# EAGLE design debug_6_005_010 (EAGLE 9.4.0)
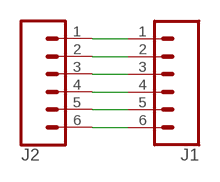
[diagram p0: schematic, sheet 1]

## Parts
J1  CONN_061.27MM  [1X06_1.27MM]
J2  CONN_06RA  [MOLEX-1X6-RA]

## Nets
N$1: J1.4 J2.4
N$2: J1.6 J2.6
N$3: J1.3 J2.3
N$4: J1.2 J2.2
N$5: J1.1 J2.1
N$6: J1.5 J2.5

## Library data of the parts
J1 J2 = SparkFun-Connectors:CONN_06: Multi connection point. Often used as Generic Header-pin footprint for 0.1 inch spaced/style header connections On any of the 0.1 inch spaced packages, you can populate with these: Break Away Headers - Straight <https://www.sparkfun.com/products/116> (PRT-00116) Break Away Male Headers - Right Angle <https://www.sparkfun.com/products/553> (PRT-00553) Female Headers <https://www.sparkfun.com/products/115> (PRT-00115) Break Away Headers - Machine Pin <https://www.sparkfun.com/products/117> (PRT-00117) Break Away Female Headers - Swiss Machine Pin <https://www.sparkfun.com/products/743> (PRT-00743) Arduino Stackable Header - 6 Pin <https://www.sparkfun.com/products/9280> (PRT-09280) For SCREWTERMINALS and SPRING TERMINALS visit here: Screw Terimnals on SparkFun.com <https://www.sparkfun.com/search/results?term=Screw+Terminals> (5mm/3.5mm/2.54mm spacing) This device is also useful as a general connection point to wire up your design to another part of your project. Our various solder wires solder well into these plated through hole pads. Hook-Up Wire - Assortment (Stranded, 22 AWG) <https://www.sparkfun.com/products/11375> (PRT-11375) Hook-Up Wire - Assortment (Solid Core, 22 AWG) <https://www.sparkfun.com/products/11367> (PRT-11367) View the entire wire category on our website here <https://www.sparkfun.com/categories/141>

## Net classes
0 default: width 0.152 mm

## Board
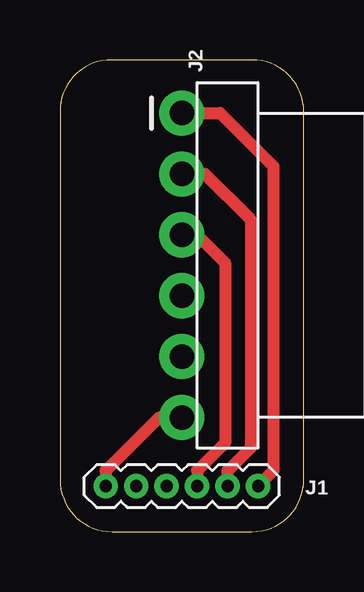
[diagram p1: board, top side]
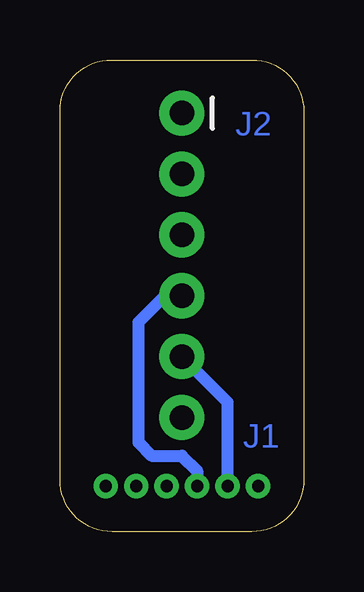
[diagram p2: board, bottom side, seen from below]

Size 10.16 x 19.68 mm. Coordinates in mm from the lower left corner, seen from the top.
Outline: 0,17.52 0,2.17 arc90 2.17,0 7.99,0 arc90 10.16,2.17 10.16,17.52 arc90 8.01,19.68 2.15,19.68 arc90 0,17.52
Copper layers (1*16): Top 0.035mm / dielectric 1.5mm / Bottom 0.035mm
Design rules "default": minimum track width 6mil, minimum drill 0.35mm, track to track 6mil, track to pad 6mil, pad to pad 6mil, via to via 6mil, smd to smd 6mil, copper to edge 40mil, drill to drill 6mil, minimum pad ring 10mil, minimum via ring 8mil, stop-mask expansion 4mil, vias tented up to drill 0mil, thermal gap 10mil

### Footprints (pad centres in the part's own frame; a part is rotated, then mirrored left to right if it is on the bottom)
1X06_1.27MM = drill 0.508 pad 1: 1 0,0; 2 1.27,0; 3 2.54,0; 4 3.81,0; 5 5.08,0; 6 6.35,0
MOLEX-1X6-RA = drill 1.016 pad 1.88: 1 0,0; 2 2.54,0; 3 5.08,0; 4 7.62,0; 5 10.16,0; 6 12.7,0

### Placement (x,y rotation side)
J1  8.26,1.91 180 top
J2  5.08,17.46 270 top

### Tracks (layer width: path | path; a pad name or v marks a point on that pad's centre or on a via)
N$1
  Bottom 0.508: J2.4 5.78,9.84 6.88,8.74 6.88,3.71 6.35,3.17 5.08,3.17 4.45,2.54 J1.4
N$2
  Top 0.508: J2.6 4.13,4.76 1.91,2.54 J1.6
N$3
  Top 0.508: J2.3 5.71,12.38 6.88,11.21 6.88,3.71 5.71,2.54 J1.3
N$4
  Top 0.508: J1.2 6.99,2.54 7.94,3.49 7.94,13.02 6.03,14.92 J2.2
N$5
  Top 0.508: J2.1 6.67,17.46 8.89,15.24 8.89,2.54 J1.1
N$6
  Bottom 0.508: J2.5 3.17,5.4 J1.5

### Text on the board
Bottom: J2 | J1